# Altium schematic sheet 04 - Auxiliary Power.SchDoc: Auxiliary Power - 25kW WolfPACK FM3 Six-Pack Inv. (part 3 of 3)
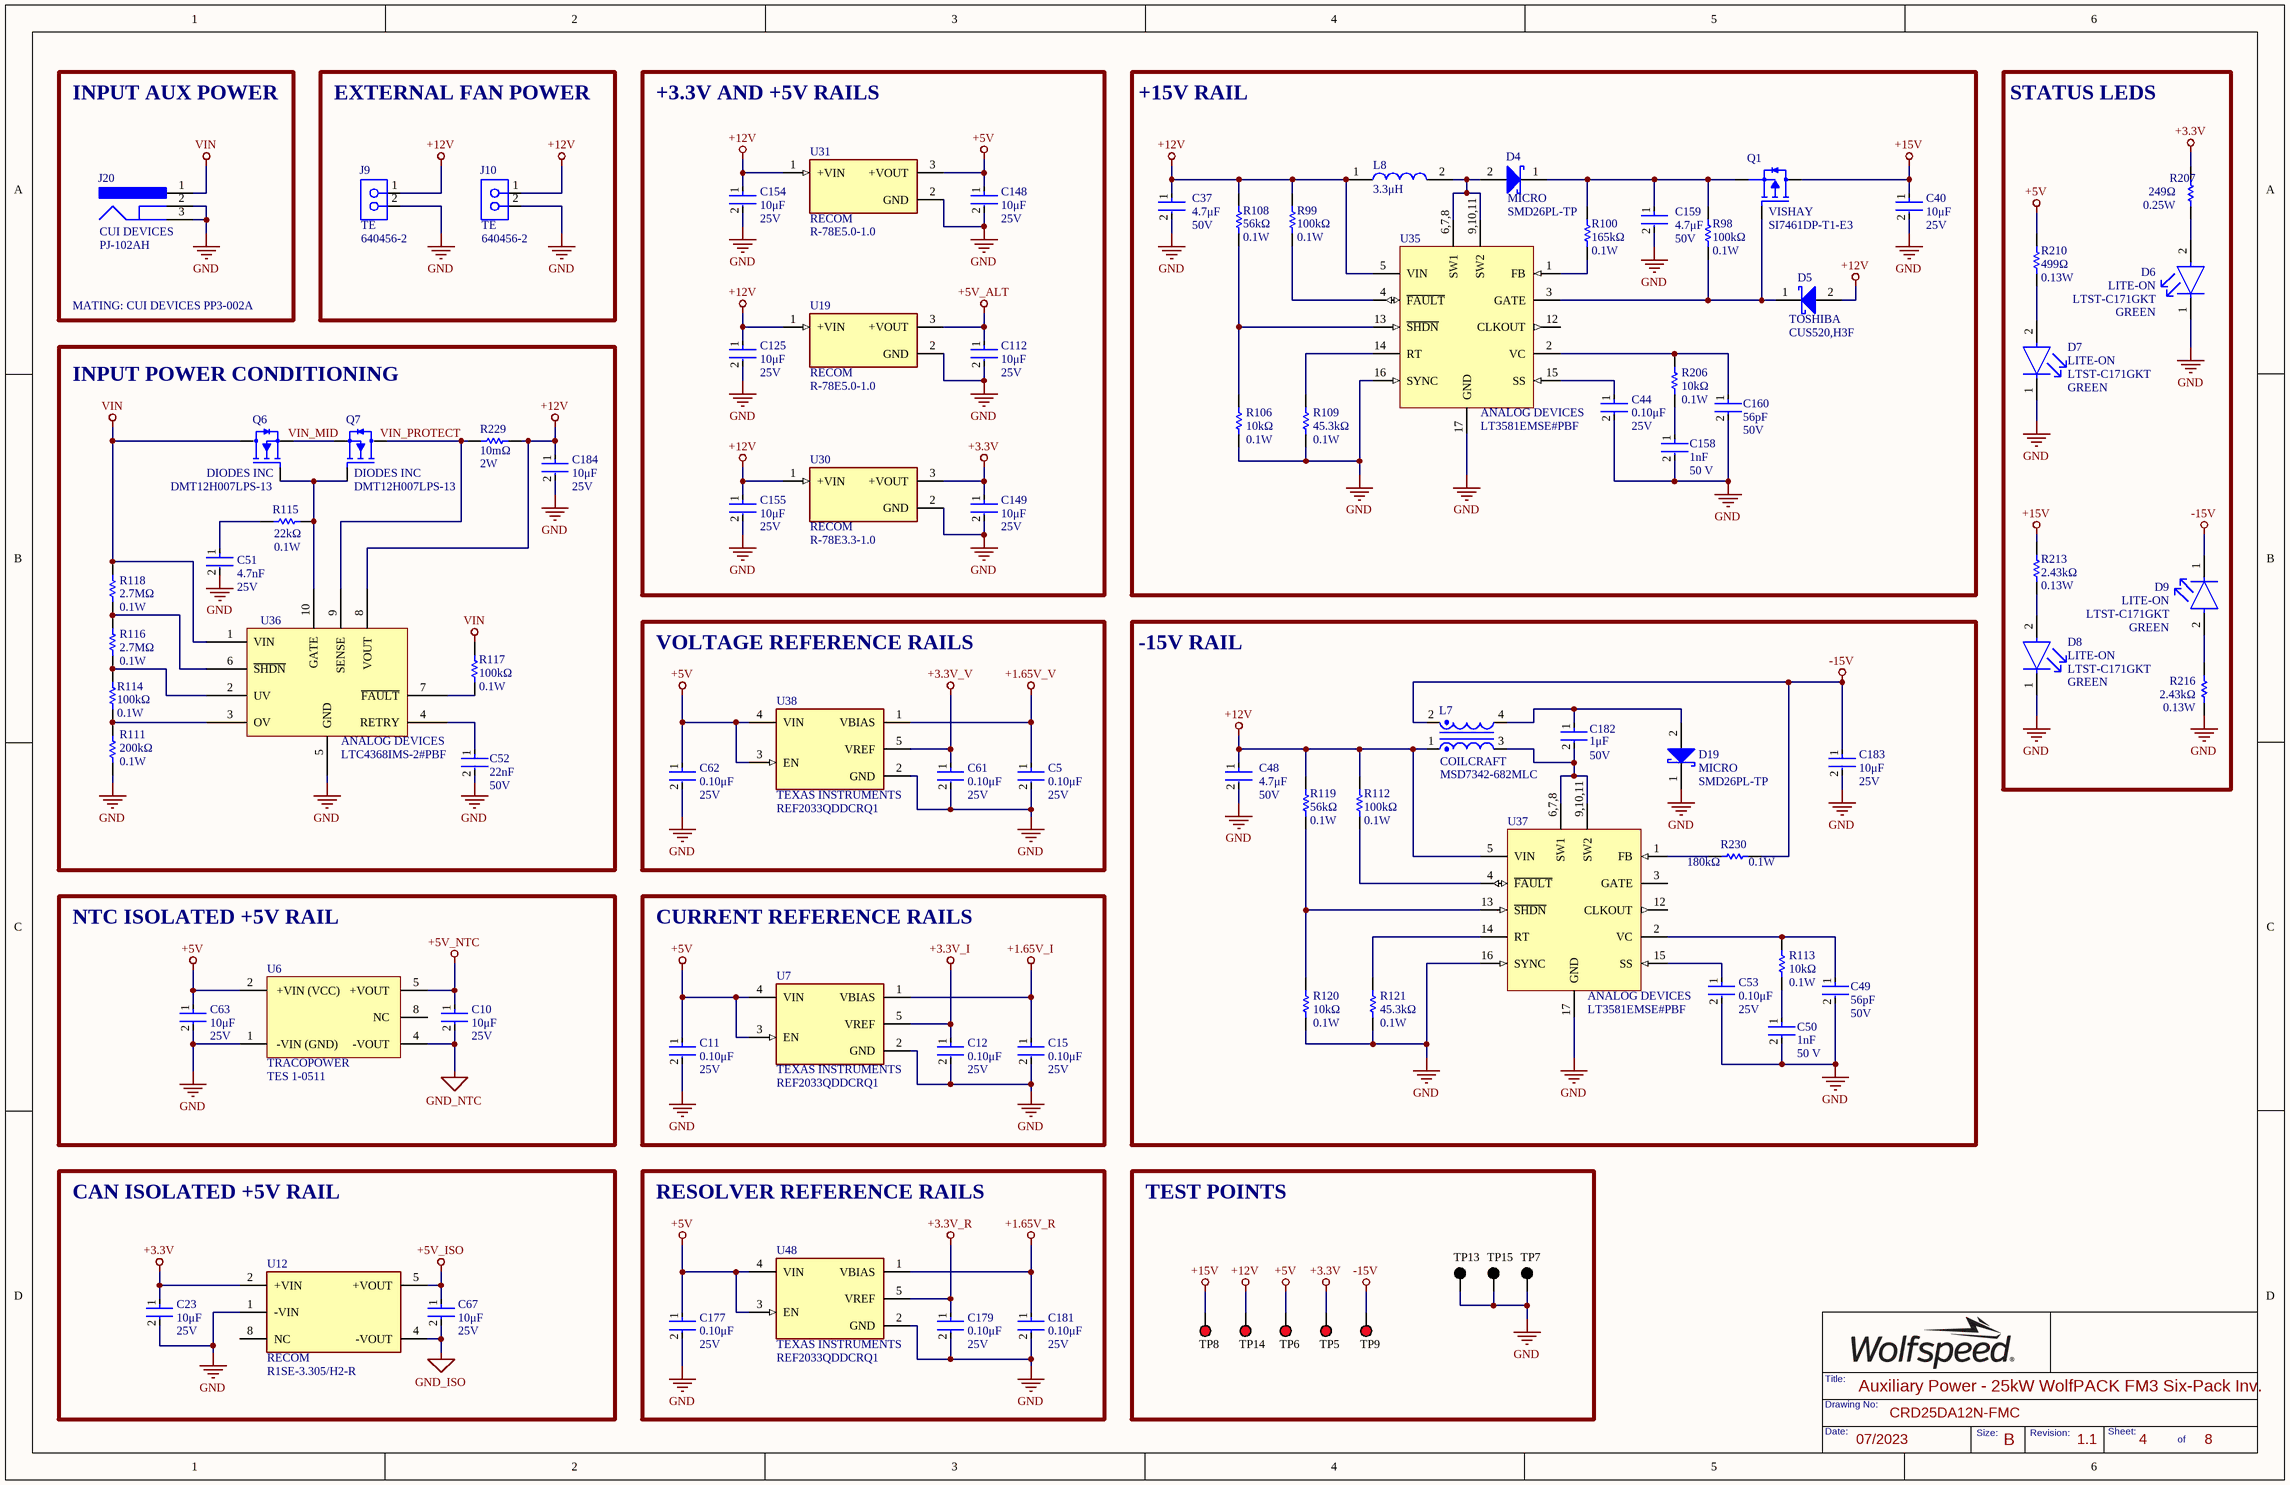
[diagram p2: 04 - Auxiliary Power.SchDoc]

## Library data of the parts (continued)
U12 = R1SE-3.305/H2-R: DC DC CONVERTER 5V 1W; Number of Outputs: 1; Min Input Voltage: 2.97V; Max Input Voltage: 3.63V; Max Output Current: 200mA; Isolation Voltage: 2kV; Efficiency: 75%; Supplier 1: Digi-Key; RoHS: Yes; Category: Board Mount Modules; Stock 1: 563; Pricing 1: 1=4.51000, 5=4.44600, 10=4.38300, 25=4.25800, 50=4.00760, 100=3.88240, 250=3.75720 (USD); Mount: Surface Mount; Case/Package: SMD/SMT; Weight: 1g; Min Operating Temperature: -40°C; Max Operating Temperature: 100°C; Packaging: Cut Tape; Voltage - Output 1: 5V; Min Input Voltage (DC): 2.97V; Max Input Voltage (DC): 3.63V; Max Output Power: 1W; Current - Output 1: 200mA; Max Power Dissipation: 1W; Max Output Voltage: 5V; Series: ECONOLINE R1SE-H2 (1W); Length: 12.75mm; Width: 10.7mm; Height: 6.7mm; Depth: 12.75mm; Reach SVHC Compliant: Yes; Lead Free: Lead Free; RoHS Compliant: Yes; ComponentLink1URL: http://www.farnell.com/datasheets/1905443.pdf?src-supplier=Farnell; ComponentLink1Description: http://www.farnell.com/datasheets/1905443.pdf?src-supplier=Farnell; ComponentLink2URL: http://www.alliedelec.com/images/products/datasheets/bm/1_Datasheets/70595177.pdf?src-supplier=Allied+Electronics; ComponentLink2Description: http://www.alliedelec.com/images/products/datasheets/bm/1_Datasheets/70595177.pdf?src-supplier=Allied+Electronics; ComponentLink3URL: https://www.recom-power.com/pdf/Econoline/R1SE_H2.pdf?src-supplier=Digi-Key; ComponentLink3Description: https://www.recom-power.com/pdf/Econoline/R1SE_H2.pdf?src-supplier=Digi-Key; ComponentLink4URL: http://www.farnell.com/datasheets/1905443.pdf?src-supplier=Element14; ComponentLink4Description: http://www.farnell.com/datasheets/1905443.pdf?src-supplier=Element14; Supplier Part Number 1: 945-R1SE-3.305/H2-RCT-ND; Value: N/A; Package: 8-SMD; Manufacturer Part Number: R1SE-3.305/H2-R
U19 U31 = R-78E5.0-1.0: DC DC CONVERTER 5V 5W; Number of Outputs: 1; Min Input Voltage: 8V; Max Input Voltage: 28V; Max Output Current: 1A; Efficiency: 91%; Supplier 1: Rs; Manufacturer: RECOM; Manufacturer Part Number: R-78E5.0-1.0; RoHS: Yes; Category: Voltage Regulators - Switching; Stock 1: 661; Mount: Through Hole; Case/Package: SIP; Weight: 2g; Min Operating Temperature: -40°C; Max Operating Temperature: 85°C; Packaging: Rail/Tube; Voltage - Output 1: 5V; Max Power Dissipation: 5W; Output Power: 5W; Current - Output 1: 1A; Package Quantity: 42; Max Output Voltage: 5V; Features: SCP; Length: 11.6mm; Width: 8.5mm; Height: 10.4mm; Lead Free: Lead Free; RoHS Compliant: Yes; ComponentLink1URL: http://www.farnell.com/datasheets/2787646.pdf?src-supplier=Farnell; ComponentLink1Description: http://www.farnell.com/datasheets/2787646.pdf?src-supplier=Farnell; ComponentLink2URL: http://www.mouser.com/ds/2/468/R-78Exx-1.0-958279.pdf?src-supplier=Mouser; ComponentLink2Description: http://www.mouser.com/ds/2/468/R-78Exx-1.0-958279.pdf?src-supplier=Mouser; ComponentLink3URL: https://www.recom-power.com/pdf/Innoline/R-78Exx-1.0.pdf?src-supplier=Digi-Key; ComponentLink3Description: https://www.recom-power.com/pdf/Innoline/R-78Exx-1.0.pdf?src-supplier=Digi-Key; ComponentLink4URL: http://www.farnell.com/datasheets/1848475.pdf?src-supplier=Newark; ComponentLink4Description: http://www.farnell.com/datasheets/1848475.pdf?src-supplier=Newark; ComponentLink5URL: http://www.farnell.com/datasheets/2787646.pdf?src-supplier=Element14; ComponentLink5Description: http://www.farnell.com/datasheets/2787646.pdf?src-supplier=Element14; ComponentLink6URL: http://datasheet.octopart.com/R-78E5.0-1.0-Recom-Power-datasheet-68298118.pdf?src-supplier=Rs; ComponentLink6Description: http://datasheet.octopart.com/R-78E5.0-1.0-Recom-Power-datasheet-68298118.pdf?src-supplier=Rs; Supplier Part Number 1: 1446013; Package: 3-SIP; Value: N/A
U30 = R-78E3.3-1.0: DC DC CONVERTER 3.3V 3W; Number of Outputs: 1; Min Input Voltage: 8V; Max Input Voltage: 28V; Max Output Current: 1A; Efficiency: 91%; Max Output Power: 3.3W; Min Input Voltage (DC): 7V; Supplier 1: Rs; Manufacturer: RECOM; Manufacturer Part Number: R-78E3.3-1.0; RoHS: Yes; Category: Board Mount Modules; Stock 1: 1; Pricing 1: 1=3.93700, 5=3.82200, 10=3.69700, 25=3.58300, 50=3.46900 (USD); Mount: Through Hole; Case/Package: SIP; Weight: 2g; Min Operating Temperature: -40°C; Max Operating Temperature: 85°C; Packaging: Rail/Tube; Voltage - Output 1: 3.3V; Nominal Output Voltage: 3.3V; Max Input Voltage (DC): 28V; Max Power Dissipation: 3W; Max Output Voltage: 3.3V; Features: SCP; Series: INNOLINE R-78E; Length: 11.6mm; Width: 8.5mm; Height: 10.4mm; Reach SVHC Compliant: Yes; Lead Free: Lead Free; RoHS Compliant: Yes; ComponentLink1URL: http://www.farnell.com/datasheets/2787646.pdf?src-supplier=Farnell; ComponentLink1Description: http://www.farnell.com/datasheets/2787646.pdf?src-supplier=Farnell; ComponentLink2URL: https://www.recom-power.com/pdf/Innoline/R-78Exx-1.0.pdf?src-supplier=Digi-Key; ComponentLink2Description: https://www.recom-power.com/pdf/Innoline/R-78Exx-1.0.pdf?src-supplier=Digi-Key; ComponentLink3URL: http://www.farnell.com/datasheets/1965125.pdf?src-supplier=Element14; ComponentLink3Description: http://www.farnell.com/datasheets/1965125.pdf?src-supplier=Element14; ComponentLink4URL: http://www.farnell.com/datasheets/2787646.pdf?src-supplier=Newark; ComponentLink4Description: http://www.farnell.com/datasheets/2787646.pdf?src-supplier=Newark; Supplier Part Number 1: 9176626; Package: 3-SIP; Value: N/A
U35 U37 = LT3581EMSE#PBF: IC REG MULTI CONFG ADJ 16MSOP; Number of Outputs: 1; Frequency Adjust Range: Up - 2.5MHz; RoHS: TRUE; PackageDescription: 16-Pin Plastic MSOP, Exposed Die Pad, Body 4.039 x 3 mm, Pitch 0.5 mm; Mounting Technology: Surface Mount; ComponentLink3URL: http://cds.linear.com/docs/en/packaging/05081667_F_MSE16.pdf; PackageReference: MSE-16; ComponentLink2Description: Datasheet; Manufacturer: ANALOG DEVICES; ComponentLink3Description: Package Specification; ComponentLink1Description: Manufacturer URL; ComponentLink1URL: http://www.linear.com/; ComponentLink2URL: http://cds.linear.com/docs/en/datasheet/3581f.pdf; PackageVersion: Rev. F, 05/2013; Supplier 1: Newark; Supplier Part Number 1: 51AK8743; Manufacturer Part Number: LT3581EMSE#PBF; Package: 16-TFSOP; Value: N/A
U36 = LTC4368IMS-2#PBF: IC SURGE SUPPRESSION ADJ 10MSOP; Supplier 1: Digi-Key; Manufacturer: ANALOG DEVICES; Manufacturer Part Number: LTC4368IMS-2#PBF; RoHS: Yes; Category: Power Management ICs; Pricing 1: 1=6.69000, 10=6.03900, 25=5.75840, 100=5.00000, 250=4.77528, 500=4.35396, 1000=3.97500 (USD); ComponentLink1URL: http://www.linear.com/docs/57622?src-supplier=Digi-Key; ComponentLink1Description: http://www.linear.com/docs/57622?src-supplier=Digi-Key; Supplier Part Number 1: 505-LTC4368IMS-2#PBF-ND; Package: 10-MSOP; Value: N/A